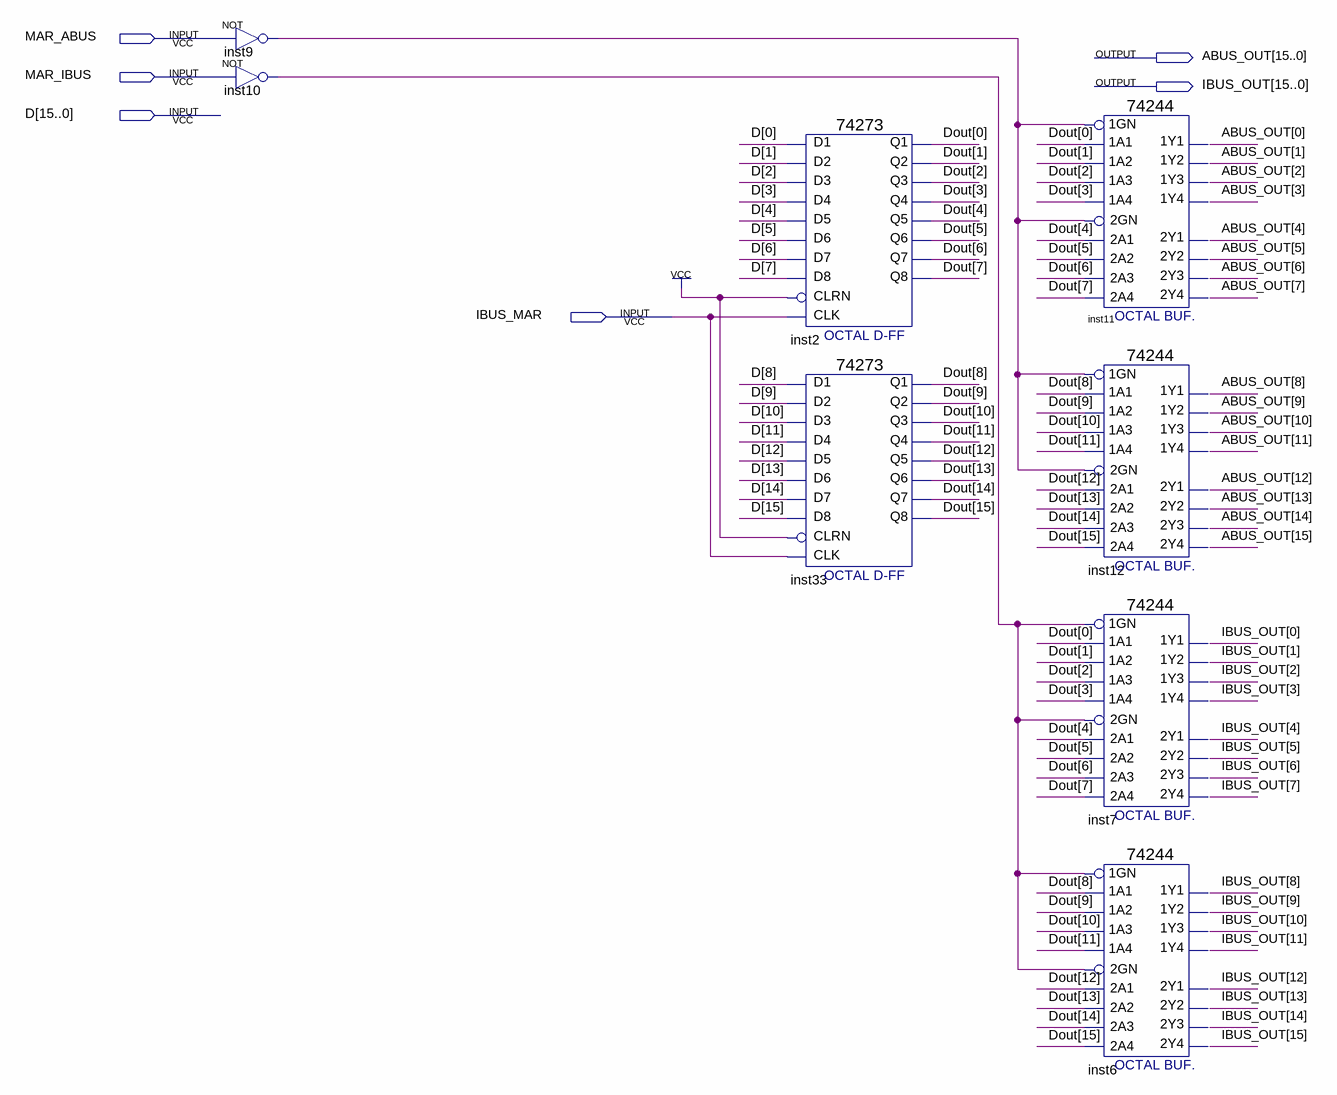
[diagram p0: schematic sheet]
// Quartus schematic MAR.bdf as structural Verilog: 8 symbols, 6 pins
module MAR (
  input  MAR_ABUS,
  input  MAR_IBUS,
  input  [15:0] D,
  input  IBUS_MAR,
  output [15:0] ABUS_OUT,
  output [15:0] IBUS_OUT
);

  wire inst9_out, inst10_out;
  wire [15:0] Dout;

  not inst9 (inst9_out, MAR_ABUS);
  not inst10 (inst10_out, MAR_IBUS);
  \74273  inst2 (
    .D2(D[1]), .D3(D[2]), .D1(D[0]), .D4(D[3]), .D7(D[6]), .D6(D[5]), .D5(D[4]), .D8(D[7]), .CLK(IBUS_MAR),
    .CLRN(1'b1), .Q4(Dout[3]), .Q1(Dout[0]), .Q2(Dout[1]), .Q3(Dout[2]), .Q6(Dout[5]), .Q5(Dout[4]),
    .Q7(Dout[6]), .Q8(Dout[7]));
  \74273  inst33 (
    .D2(D[9]), .D3(D[10]), .D1(D[8]), .D4(D[11]), .D7(D[14]), .D6(D[13]), .D5(D[12]), .D8(D[15]),
    .CLK(IBUS_MAR), .CLRN(1'b1), .Q4(Dout[11]), .Q1(Dout[8]), .Q2(Dout[9]), .Q3(Dout[10]), .Q6(Dout[13]),
    .Q5(Dout[12]), .Q7(Dout[14]), .Q8(Dout[15]));
  \74244  inst11 (
    .\1A2 (Dout[1]), .\1A4 (Dout[3]), .\1A1 (Dout[0]), .\1A3 (Dout[2]), .\1GN (inst9_out), .\2A3 (Dout[6]),
    .\2GN (inst9_out), .\2A1 (Dout[4]), .\2A4 (Dout[7]), .\2A2 (Dout[5]), .\1Y2 (ABUS_OUT[1]),
    .\1Y4 (ABUS_OUT[3]), .\2Y1 (ABUS_OUT[4]), .\1Y1 (ABUS_OUT[0]), .\2Y3 (ABUS_OUT[6]), .\2Y4 (ABUS_OUT[7]),
    .\1Y3 (ABUS_OUT[2]), .\2Y2 (ABUS_OUT[5]));
  \74244  inst12 (
    .\1A2 (Dout[9]), .\1A4 (Dout[11]), .\1A1 (Dout[8]), .\1A3 (Dout[10]), .\1GN (inst9_out),
    .\2A3 (Dout[14]), .\2GN (inst9_out), .\2A1 (Dout[12]), .\2A4 (Dout[15]), .\2A2 (Dout[13]),
    .\1Y2 (ABUS_OUT[9]), .\1Y4 (ABUS_OUT[11]), .\2Y1 (ABUS_OUT[12]), .\1Y1 (ABUS_OUT[8]),
    .\2Y3 (ABUS_OUT[14]), .\2Y4 (ABUS_OUT[15]), .\1Y3 (ABUS_OUT[10]), .\2Y2 (ABUS_OUT[13]));
  \74244  inst7 (
    .\1A2 (Dout[1]), .\1A4 (Dout[3]), .\1A1 (Dout[0]), .\1A3 (Dout[2]), .\1GN (inst10_out), .\2A3 (Dout[6]),
    .\2GN (inst10_out), .\2A1 (Dout[4]), .\2A4 (Dout[7]), .\2A2 (Dout[5]), .\1Y2 (IBUS_OUT[1]),
    .\1Y4 (IBUS_OUT[3]), .\2Y1 (IBUS_OUT[4]), .\1Y1 (IBUS_OUT[0]), .\2Y3 (IBUS_OUT[6]), .\2Y4 (IBUS_OUT[7]),
    .\1Y3 (IBUS_OUT[2]), .\2Y2 (IBUS_OUT[5]));
  \74244  inst6 (
    .\1A2 (Dout[9]), .\1A4 (Dout[11]), .\1A1 (Dout[8]), .\1A3 (Dout[10]), .\1GN (inst10_out),
    .\2A3 (Dout[14]), .\2GN (inst10_out), .\2A1 (Dout[12]), .\2A4 (Dout[15]), .\2A2 (Dout[13]),
    .\1Y2 (IBUS_OUT[9]), .\1Y4 (IBUS_OUT[11]), .\2Y1 (IBUS_OUT[12]), .\1Y1 (IBUS_OUT[8]),
    .\2Y3 (IBUS_OUT[14]), .\2Y4 (IBUS_OUT[15]), .\1Y3 (IBUS_OUT[10]), .\2Y2 (IBUS_OUT[13]));
endmodule
